# EAGLE design mLRS-rx-E28-G4-v007 (EAGLE 7.5.0)
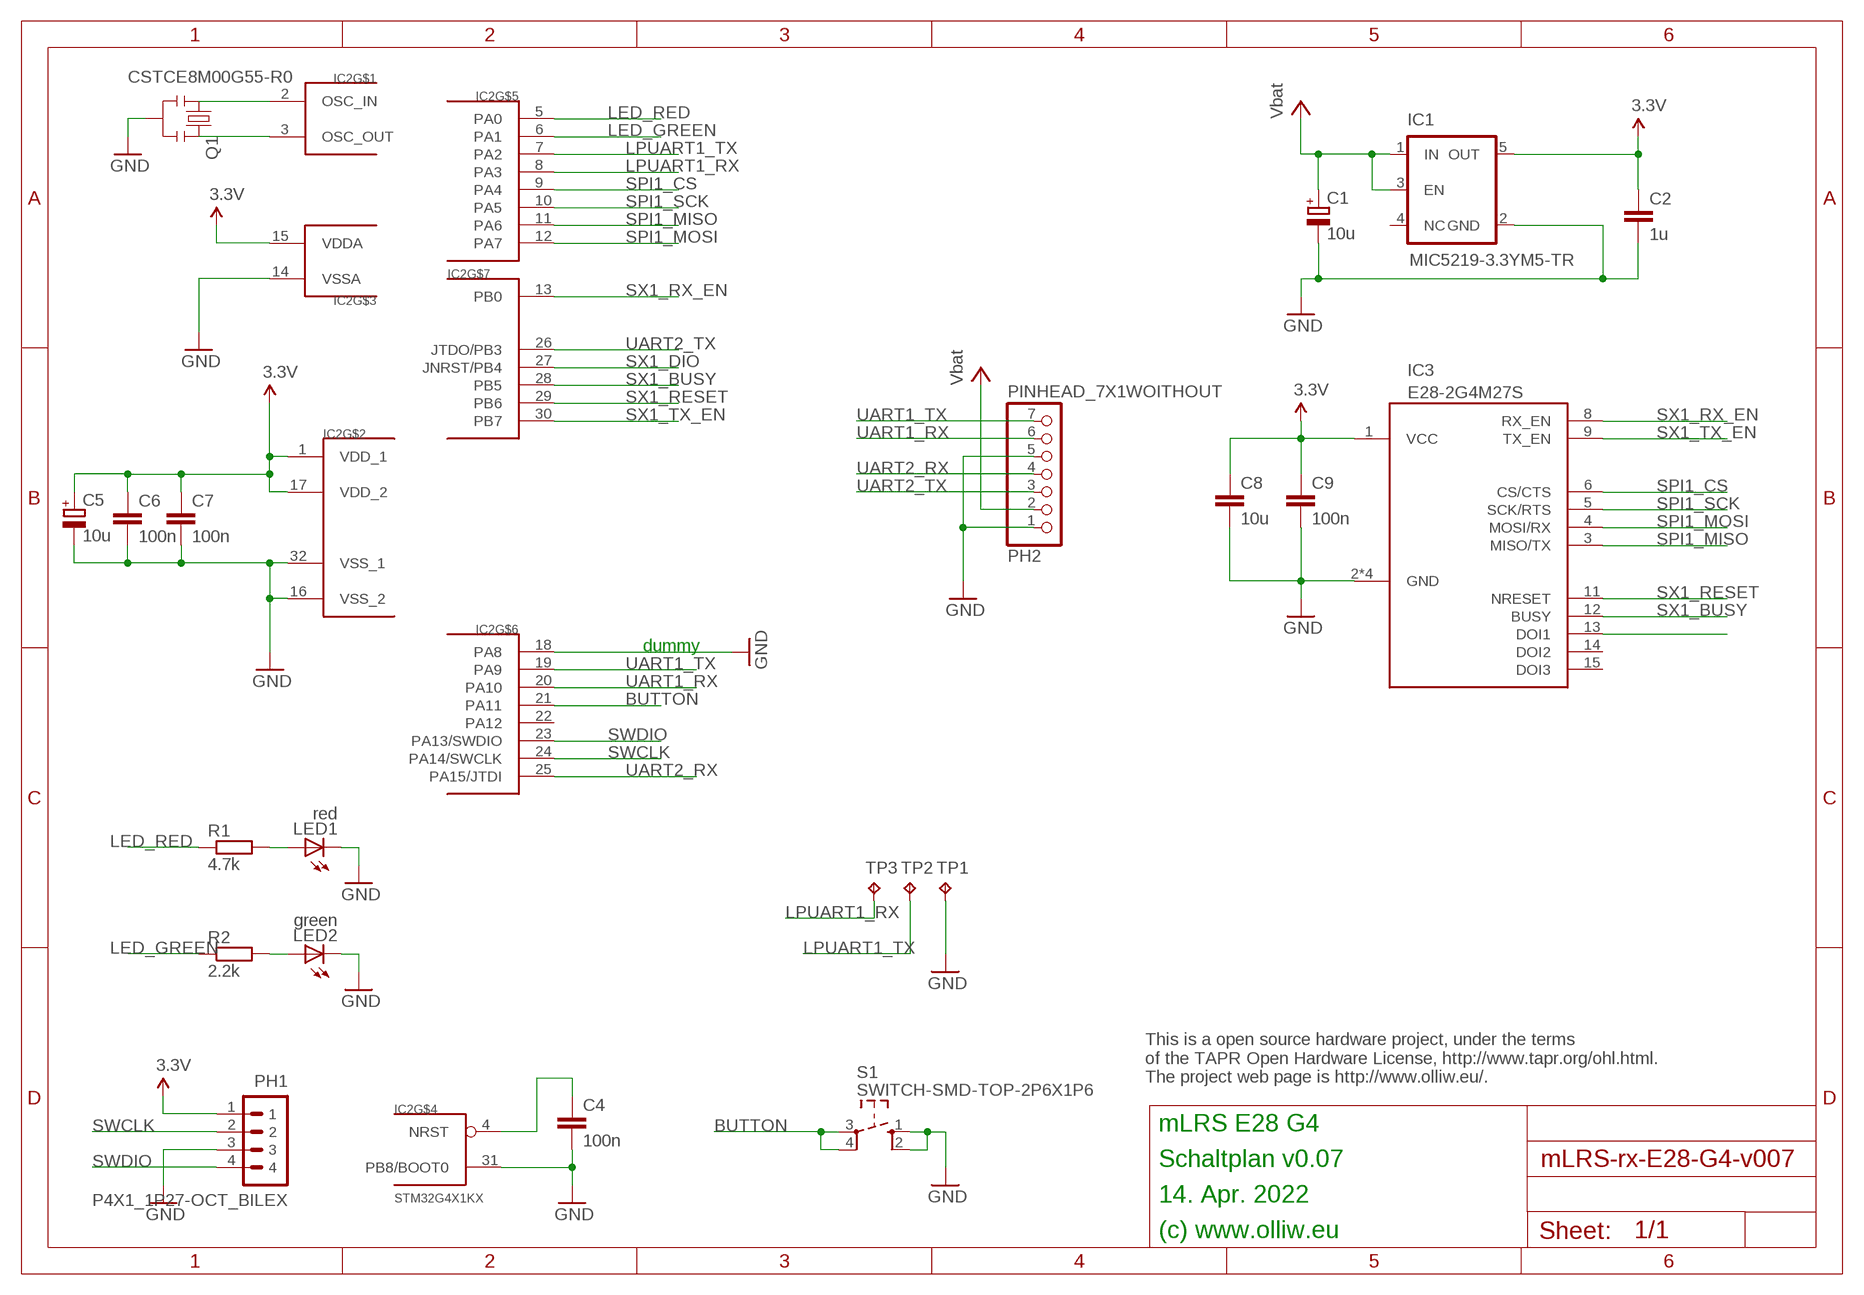
[diagram p0: schematic, sheet 1]

## Parts
C1  10u  CPOL-EUSMCA  [SMC_A]
C2  1u  C-EUC0603K  [C0603K]
C4  100n  C-EUC0402  [C0402]
C5  10u  CPOL-EUSMCA  [SMC_A]
C6  100n  C-EUC0402  [C0402]
C7  100n  C-EUC0402  [C0402]
C8  10u  C-EUC0603  [C0603]
C9  100n  C-EUC0402  [C0402]
IC1  MIC5219-3.3YM5-TR  V_REG_TPS76433SOT23-5  [SOT23-5]
IC2  STM32G4X1KX  [UFQFPN32]
IC3  E28-2G4M27S  E28  [E28-2G4M27]
LED1  red  LEDCHIPLED_0603  [CHIPLED_0603]
LED2  green  LEDCHIPLED_0603  [CHIPLED_0603]
PH1  P4X1_1P27-OCT_BILEX  [4X1_1P27_OCT_BILEX]
PH2  PINHEAD_7X1WOITHOUT  [PINHEAD_7X1_WO]
Q1  CSTCE8M00G55-R0  RESONATORSMD  [RESONATOR-SMD]
R1  4.7k  R-EU_R0402  [R0402]
R2  2.2k  R-EU_R0402  [R0402]
S1  SWITCH-SMD-TOP-2P6X1P6  [TACTILE-SWITCH-SMD-TOP-2P6X1X6]
TP1  TPB1,27  [B1,27]
TP2  TPB1,27  [B1,27]
TP3  TPB1,27  [B1,27]

## Nets
3.3V: C2.1 C5.+ C6.1 C7.1 C8.1 C9.1 IC1.5(OUT) IC2.1(VDD_1) IC2.15(VDDA) IC2.17(VDD_2) IC3.1(VCC) PH1.1
BUTTON: IC2.21(PA11) S1.3 S1.4
GND: C1.- C2.2 C4.2 C5.- C6.2 C7.2 C8.2 C9.2 IC1.2(GND) IC2.14(VSSA) IC2.16(VSS_2) IC2.18(PA8) IC2.31(PB8/BOOT0) IC2.32(VSS_1) IC3.2(GND) IC3.7(GND) IC3.10(GND) IC3.16(GND) LED1.C LED2.C PH1.3 PH2.1 PH2.5 Q1.2 S1.1 S1.2 TP1.TP
LED_GREEN: IC2.6(PA1) R2.1
LED_RED: IC2.5(PA0) R1.1
LPUART1_RX: IC2.8(PA3) TP3.TP
LPUART1_TX: IC2.7(PA2) TP2.TP
N$5: C4.1 IC2.4(NRST)
N$12: IC2.3(OSC_OUT) Q1.3
N$14: IC2.2(OSC_IN) Q1.1
N$17: LED1.A R1.2
N$19: LED2.A R2.2
SPI1_CS: IC2.9(PA4) IC3.6(CS/CTS)
SPI1_MISO: IC2.11(PA6) IC3.3(MISO/TX)
SPI1_MOSI: IC2.12(PA7) IC3.4(MOSI/RX)
SPI1_SCK: IC2.10(PA5) IC3.5(SCK/RTS)
SWCLK: IC2.24(PA14/SWCLK) PH1.2
SWDIO: IC2.23(PA13/SWDIO) PH1.4
SX1_BUSY: IC2.28(PB5) IC3.12(BUSY)
SX1_DIO: IC2.27(JNRST/PB4) IC3.13(DOI1)
SX1_RESET: IC2.29(PB6) IC3.11(NRESET)
SX1_RX_EN: IC2.13(PB0) IC3.8(RX_EN)
SX1_TX_EN: IC2.30(PB7) IC3.9(TX_EN)
UART1_RX: IC2.20(PA10) PH2.6
UART1_TX: IC2.19(PA9) PH2.7
UART2_RX: IC2.25(PA15/JTDI) PH2.4
UART2_TX: IC2.26(JTDO/PB3) PH2.3
VCC: C1.+ IC1.1(IN) IC1.3(EN) PH2.2 ; supply symbol labelled Vbat
Unconnected: IC1.4(NC) IC2.22(PA12) IC3.14(DOI2) IC3.15(DOI3)

## Notes on the sheet
- dummy
- This is a open source hardware project, under the terms
  of the TAPR Open Hardware License, http://www.tapr.org/ohl.html.
  The project web page is http://www.olliw.eu/.
- mLRS E28 G4
- Schaltplan v0.07
- 14. Apr. 2022
- (c) www.olliw.eu

## Library data of the parts
C1 C5 = rcl:CPOL-EU: POLARIZED CAPACITOR, European symbol
C2 C4 C6-C9 = rcl:C-EU: CAPACITOR, European symbol
IC1 = # SparkFun2:V_REG_TPS76433: Voltage Regulator Older TI part. LDO 150mA regulator. No output by-pass cap option. See V_REG_LDO for a better part.
IC2 = # stm32:STM32G4X1KX
IC3 = # stdlib:E28
LED1 LED2 = led:LED: LED OSRAM: - CHIPLED LG R971, LG N971, LY N971, LG Q971, LY Q971, LO R971, LY R971 LH N974, LH R974 LS Q976, LO Q976, LY Q976 LO Q996 - Hyper CHIPLED LW Q18S LB Q993, LB Q99A, LB R99A - SideLED LS A670, LO A670, LY A670, LG A670, LP A670 LB A673, LV A673, LT A673, LW A673 LH A674 LY A675 LS A676, LA A676, LO A676, LY A676, LW A676 LS A679, LY A679, LG A679 - Hyper Micro SIDELED® LS Y876, LA Y876, LO Y876, LY Y876 LT Y87S - SmartLED LW L88C, LW L88S LB L89C, LB L89S, LG L890 LS L89K, LO L89K, LY L89K LS L896, LA L896, LO L896, LY L896 - TOPLED LS T670, LO T670, LY T670, LG T670, LP T670 LSG T670, LSP T670, LSY T670, LOP T670, LYG T670 LG T671, LOG T671, LSG T671 LB T673, LV T673, LT T673, LW T673 LH T674 LS T676, LA T676, LO T676, LY T676, LB T676, LH T676, LSB T676, LW T676 LB T67C, LV T67C, LT T67C, LS T67K, LO T67K, LY T67K, LW E67C LS E67B, LA E67B, LO E67B, LY E67B, LB E67C, LV E67C, LT E67C LW T67C LS T679, LY T679, LG T679 LS T770, LO T770, LY T770, LG T770, LP T770 LB T773, LV T773, LT T773, LW T773 LH T774 LS E675, LA E675, LY E675, LS T675 LS T776, LA T776, LO T776, LY T776, LB T776 LHGB T686 LT T68C, LB T68C - Hyper Mini TOPLED® LB M676 - Mini TOPLED Santana® LG M470 LS M47K, LO M47K, LY M47K Source: http://www.osram.convergy.de LUXEON: - LUMILED® LXK2-PW12-R00, LXK2-PW12-S00, LXK2-PW14-U00, LXK2-PW14-V00 LXK2-PM12-R00, LXK2-PM12-S00, LXK2-PM14-U00 LXK2-PE12-Q00, LXK2-PE12-R00, LXK2-PE12-S00, LXK2-PE14-T00, LXK2-PE14-U00 LXK2-PB12-K00, LXK2-PB12-L00, LXK2-PB12-M00, LXK2-PB14-N00, LXK2-PB14-P00, LXK2-PB14-Q00 LXK2-PR12-L00, LXK2-PR12-M00, LXK2-PR14-Q00, LXK2-PR14-R00 LXK2-PD12-Q00, LXK2-PD12-R00, LXK2-PD12-S00 LXK2-PH12-R00, LXK2-PH12-S00 LXK2-PL12-P00, LXK2-PL12-Q00, LXK2-PL12-R00 Source: www.luxeon.com KINGBRIGHT: KA-3528ASYC Source: www.kingbright.com
PH1 = # stdlib:P4X1_1P27
PH2 = # stdlib:PINHEAD_7X1
Q1 = # SparkFun2:RESONATOR: Resonator Small SMD resonator. This is the itty bitty 10/20MHz resonators with built in caps. CSTCE10M0G55 and CSTCE20M0V53. Footprint has been reviewed closely but hasn't been tested yet.
R1 R2 = rcl:R-EU_: RESISTOR, European symbol
S1 = # stdlib:SWITCH-SMD-TOP-2P6X1P6
TP1-TP3 = testpad:TP: Test pad

## Board
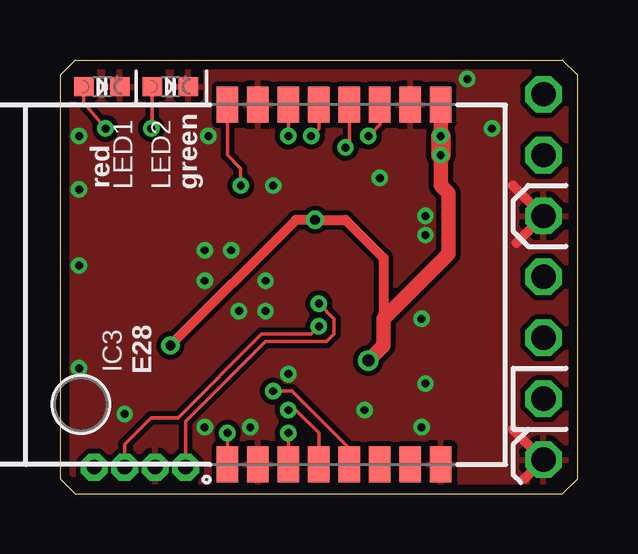
[diagram p1: board, top side]
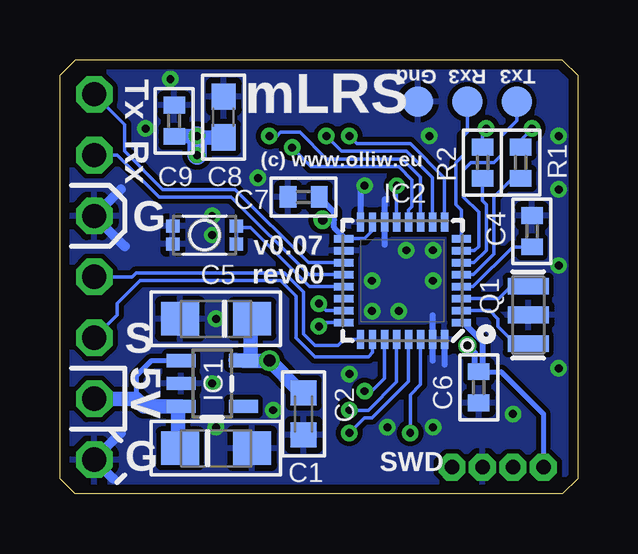
[diagram p2: board, bottom side, seen from below]

Size 21.59 x 18.1 mm. Coordinates in mm from the lower left corner, seen from the top.
Outline: 20.96,0 21.59,0.64 21.59,17.46 20.96,18.1 0.64,18.1 0,17.46 0,0.64 0.64,0 20.96,0
Copper layers (1*16): Top 0.0356mm / dielectric 1.5011mm / Bottom 0.0356mm
Design rules "ow-oshpark-2layer": minimum track width 6mil, minimum drill 13mil, track to track 6mil, track to pad 6mil, pad to pad 6mil, via to via 6mil, smd to smd 6mil, copper to edge 15mil, drill to drill 6mil, minimum pad ring 7mil, minimum via ring 7mil, stop-mask expansion 2.5mil, vias tented up to drill 26mil, thermal gap 10mil

### Footprints (pad centres in the part's own frame; a part is rotated, then mirrored left to right if it is on the bottom)
SMC_A = smd 1.6 x 1.4: + -1.5,0; - 1.5,0
C0603K = smd 1.05 x 1.08: 1 -0.875,0; 2 0.875,0
C0402 = smd 0.7 x 0.9: 1 -0.65,0; 2 0.65,0
C0603 = smd 1.1 x 1: 1 -0.85,0; 2 0.85,0
SOT23-5 = smd 0.55 x 1.2: 1 -0.95,-1.3; 2 0,-1.3; 3 0.95,-1.3; 4 0.95,1.3; 5 -0.95,1.3
UFQFPN32 = smd 0.8 x 0.3: 1 -2.45,1.75; 2 -2.45,1.25; 3 -2.45,0.75; 4 -2.45,0.25; 5 -2.45,-0.25; 6 -2.45,-0.75; 7 -2.45,-1.25; 8 -2.45,-1.75; 17 2.45,-1.75; 18 2.45,-1.25; 19 2.45,-0.75; 20 2.45,-0.25; 21 2.45,0.25; 22 2.45,0.75; 23 2.45,1.25; 24 2.45,1.75 | smd 0.3 x 0.8: 9 -1.75,-2.45; 10 -1.25,-2.45; 11 -0.75,-2.45; 12 -0.25,-2.45; 13 0.25,-2.45; 14 0.75,-2.45; 15 1.25,-2.45; 16 1.75,-2.45; 25 1.75,2.45; 26 1.25,2.45; 27 0.75,2.45; 28 0.25,2.45; 29 -0.25,2.45; 30 -0.75,2.45; 31 -1.25,2.45; 32 -1.75,2.45
E28-2G4M27 = smd 1.5 x 0.9: 1 7.5,0; 2 7.5,1.27; 3 7.5,2.54; 4 7.5,3.81; 5 7.5,5.08; 6 7.5,6.35; 7 7.5,7.62; 8 7.5,8.89; 9 -7.5,8.89; 10 -7.5,7.62; 11 -7.5,6.35; 12 -7.5,5.08; 13 -7.5,3.81; 14 -7.5,2.54; 15 -7.5,1.27; 16 -7.5,0
CHIPLED_0603 = smd 0.8 x 0.8: A 0,-0.75; C 0,0.75
4X1_1P27_OCT_BILEX = drill 0.61 pad 1.118 octagon: 1 0,0; 2 0,-1.27; 3 0,-2.54; 4 0,-3.81
PINHEAD_7X1_WO = drill 1.016 octagon: 1 0,0; 2 0,-2.54; 3 0,-5.08; 4 0,-7.62; 5 0,-10.16; 6 0,-12.7; 7 0,-15.24
RESONATOR-SMD = smd 0.7 x 1.7: 1 -1.2,0; 2 0,0; 3 1.2,0
R0402 = smd 0.7 x 0.9: 1 -0.65,0; 2 0.65,0
TACTILE-SWITCH-SMD-TOP-2P6X1X6 = smd 0.55 x 0.55: 1 -1.325,0.375; 2 -1.325,-0.375; 3 1.325,-0.375; 4 1.325,0.375
B1,27 = smd 1.27 x 1.27: TP 0,0

### Placement (x,y rotation side)
C1  15.08,1.91 0 bottom
C2  11.43,3.33 270 bottom
C4  1.9,10.95 90 bottom
C5  15.08,7.3 180 bottom
C6  4.13,4.45 270 bottom
C7  11.43,12.38 180 bottom
C8  14.76,15.72 90 bottom
C9  16.83,15.56 90 bottom
IC1  15.24,4.6 270 bottom
IC2  7.3,8.89 180 bottom
IC3  15.87,8.73 90 top
LED1  1.75,16.99 270 top
LED2  4.6,16.99 270 top
PH1  1.43,1.11 90 top
PH2  20.16,1.43 180 top
Q1  2.06,7.46 90 bottom
R1  2.38,13.81 90 bottom
R2  3.97,13.81 90 bottom
S1  15.56,10.8 0 bottom
TP1  6.67,16.35 0 bottom
TP2  2.54,16.35 0 bottom
TP3  4.6,16.35 0 bottom

### Tracks (layer width: path | path; a pad name or v marks a point on that pad's centre or on a via)
3.3V  (via drill 0.33, 0.4, 0.5)
  Top 0.406: 13.49,7.3 13.49,9.84 11.91,11.43 v10.64,11.43 9.84,11.43 v4.6,6.19
  Top 0.61: v12.86,5.56 13.49,6.19 13.49,7.3 16.19,10 16.19,12.54 15.87,12.86 v15.87,14.13 | IC3.1 v15.87,14.92
  Top 0.813: v15.87,14.13 v15.87,14.92
  Bottom 0.152: IC2.15 8.55,10.97 8.89,10.64 IC2.17
  Bottom 0.203: C6.1 3.19,5.1 1.43,3.33 PH1.1
  Bottom 0.254: C7.1 10.46,12.05 10.16,11.75 10.16,11.43 | IC2.17 9.75,10.71 10.16,11.11 10.16,11.43 | C5.+ 13.74,6.76 | 10.16,11.43 v10.64,11.43 | IC2.1 4.76,7.14 3.97,6.35 3.97,5.4 C6.1 4.27,5.25 4.29,5.24 4.29,5.87 v4.6,6.19
  Bottom 0.406: 13.65,7.07 C5.+
  Bottom 0.61: 13.65,7.07 13.65,5.56 14.26,5.59 IC1.5 12.93,5.55 12.93,5.64 v12.86,5.56 11.67,4.37 C2.1 | C8.1 15.98,14.87 v15.87,14.92 16.97,14.92 C9.1
  Bottom 0.813: v15.87,14.13 v15.87,14.92
BUTTON
  Bottom 0.152: S1.3 S1.4 14.17,11.11 13.65,11.11 11.18,8.64 IC2.21
GND  (via drill 0.33)
  Top 0.406: 18.89,2.7 PH2.1 19.37,0.64 | 18.89,12.86 PH2.5 19.05,10.48
  Bottom 0.152: 5.55,6.67 IC2.32
  Bottom 0.254: 5.55,6.67 5.55,5.4 | 6.05,7.46 6.05,5.56 | 8.05,12.29 8.05,10.39 | 9.05,12.99 9.05,11.08
  Bottom 0.406: 19.05,12.7 PH2.5 18.89,10.32 | 19.05,2.54 PH2.1 19.37,0.64
  other vias: 16.99,17.3 15.08,7.3 15.24,4.6 12.7,3.49 7.94,2.78 15.08,2.78 6.03,2.78 2.7,3.33 7.46,7.62 8.57,7.62 6.03,8.89 6.03,10.16 7.14,10.16 8.57,8.89 13.33,13.18 18.02,15.24 8.89,12.86 6.19,14.92 9.53,5 0.79,12.7 0.79,9.53 0.79,14.92 0.79,5.24 15.24,11.59 15.24,10.8
  pour Bottom (isolate 0.203, rank 6): 0.16,17.94 21.27,17.94 21.27,0.16 0.16,0.16
  pour Top (isolate 0.203, rank 6): 0.16,17.94 21.27,17.94 21.27,0.16 0.16,0.16
LED_GREEN
  Bottom 0.152: IC2.6 4.33,9.64 3.81,10.16 3.81,12.07 3.97,12.22 R2.1
LED_RED
  Bottom 0.152: IC2.5 4.35,9.14 3.49,10 3.49,12.38 2.71,13.16 R1.1
LPUART1_RX
  Bottom 0.152: IC2.8 4.85,11.84 5.08,12.07 5.08,13.81 4.76,14.13 4.76,14.92 4.6,15.08 TP3.TP
LPUART1_TX
  Bottom 0.152: IC2.7 4.31,10.14 4.13,10.32 4.13,11.75 4.76,12.38 4.76,13.49 4.45,13.81 3.49,13.81 3.18,14.13 3.18,14.92 2.54,15.56 TP2.TP
N$5
  Bottom 0.152: IC2.4 4.38,8.64 2.71,10.3 C4.1
N$12
  Bottom 0.152: IC2.3 3.29,8.14 2.7,8.73 1.99,8.73 Q1.3
N$14
  Bottom 0.152: IC2.2 3.67,7.64 3.33,7.3 3.33,6.99 2.86,6.51 1.99,6.51 Q1.1
N$17  (via drill 0.33)
  Top 0.152: LED1.A 1,16.31 v1.9,15.24
  Bottom 0.152: R1.2 2.38,14.76 v1.9,15.24
N$19  (via drill 0.33)
  Top 0.152: LED2.A 3.85,15.36 v3.81,15.24
  Bottom 0.152: R2.2 3.97,15.08 v3.81,15.24
SPI1_CS  (via drill 0.33)
  Top 0.152: v9.53,14.92 IC3.6
  Bottom 0.152: IC2.9 5.55,13.17 6.98,14.61 9.21,14.61 v9.53,14.92
SPI1_MISO  (via drill 0.33)
  Top 0.152: IC3.3 13.33,15.4 v12.86,14.92
  Bottom 0.152: IC2.11 6.55,13.22 7.3,13.97 10.48,13.97 11.59,15.08 12.38,15.08 12.54,14.92 v12.86,14.92
SPI1_MOSI  (via drill 0.33)
  Top 0.152: IC3.4 12.06,14.61 v11.91,14.45
  Bottom 0.152: v11.91,14.45 11.11,13.65 7.46,13.65 6.91,13.1 6.91,11.99 7.05,11.84 IC2.12
SPI1_SCK  (via drill 0.33)
  Top 0.152: IC3.5 10.79,15.24 v10.48,14.92
  Bottom 0.152: IC2.10 6.05,13.2 7.14,14.29 9.84,14.29 v10.48,14.92
SWCLK  (via drill 0.33)
  Top 0.152: PH1.2 2.7,2.06 3.81,3.18 4.92,3.18 8.41,6.67 10.48,6.67 v10.79,6.99
  Bottom 0.152: IC2.24 10.63,7.14 v10.79,6.99
SWDIO  (via drill 0.33)
  Top 0.152: PH1.4 5.24,3.02 8.57,6.35 11.11,6.35 11.43,6.67 11.43,7.3 v10.79,7.94
  Bottom 0.152: IC2.23 10.5,7.64 v10.79,7.94
SX1_BUSY  (via drill 0.33)
  Top 0.152: v9.53,3.49 9.84,3.49 10.79,2.54 IC3.12
  Bottom 0.152: v9.53,3.49 8.73,3.49 7.55,4.67 IC2.28
SX1_DIO  (via drill 0.33)
  Top 0.152: IC3.13 12.06,1.91 9.68,4.29 v8.89,4.29
  Bottom 0.152: v8.89,4.29 8.57,4.29 8.05,4.81 IC2.27
SX1_RESET  (via drill 0.33)
  Top 0.152: v9.53,2.54 IC3.11
  Bottom 0.152: IC2.29 7.05,4.7 8.57,3.18 8.89,3.18 v9.53,2.54
SX1_RX_EN  (via drill 0.33)
  Top 0.152: IC3.8 6.98,14.13 7.54,13.57 v7.54,12.86
  Bottom 0.152: IC2.13 7.55,12.69 v7.54,12.86
SX1_TX_EN  (via drill 0.33)
  Top 0.152: v6.98,2.54 IC3.9
  Bottom 0.152: IC2.30 6.55,4.56 6.98,4.13 v6.98,2.54
UART1_RX
  Bottom 0.152: IC2.20 11.2,9.14 14.45,12.38 17.46,12.38 19.21,14.13 PH2.6
UART1_TX
  Bottom 0.152: IC2.19 11.23,9.64 14.29,12.7 17.3,12.7 18.89,14.29 18.89,15.4 PH2.7
UART2_RX
  Bottom 0.152: IC2.25 9.75,6.44 10,6.19 10.95,6.19 11.43,6.67 11.43,8.41 12.22,9.21 18.42,9.21 18.57,9.05 PH2.4
UART2_TX
  Bottom 0.152: IC2.26 8.55,5.89 8.73,5.72 10.95,5.72 11.75,6.51 11.75,8.26 12.38,8.89 18.26,8.89 19.21,7.94 19.21,7.46 PH2.3
VCC
  Bottom 0.203: IC1.1 17.78,5.55 18.42,4.92 18.42,3.97
  Bottom 0.406: 16.7,1.79 C1.+ | 16.86,3.65 IC1.3
  Bottom 0.61: IC1.3 16.67,3.65 | 16.67,3.65 16.67,2.06 16.7,2.03 16.7,1.79 | 16.67,3.65 16.86,3.65 18.1,3.65 18.42,3.97 PH2.2

### Text on the board
tNames: green | red | E28
bNames: Tx3 | Rx3 | Gnd | Tx | mLRS | Rx | (c) www.olliw.eu | v0.07 / rev00 | G | 5V | S | SWD | G